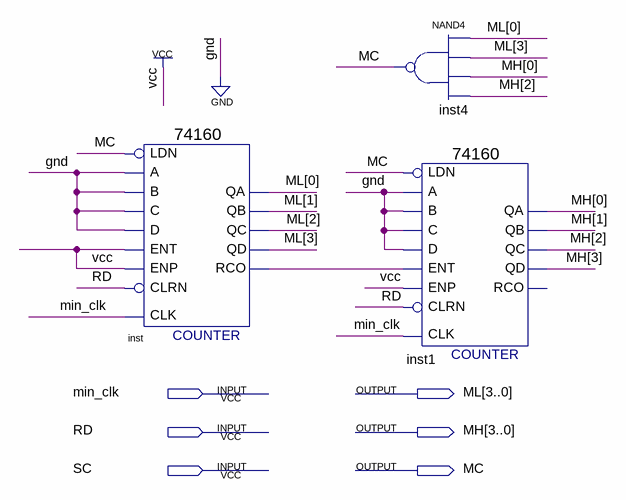
[diagram p0: schematic sheet]
// Quartus schematic min.bdf as structural Verilog: 3 symbols, 6 pins
module min (
  input  min_clk,
  input  RD,
  input  SC,
  output [3:0] ML,
  output [3:0] MH,
  output MC
);

  wire inst_rco;

  \74160  inst (
    .CLK(min_clk), .ENT(1'b1), .A(1'b0), .B(1'b0), .C(1'b0), .D(1'b0), .LDN(MC), .ENP(1'b1), .CLRN(RD),
    .QD(ML[3]), .QA(ML[0]), .QB(ML[1]), .QC(ML[2]), .RCO(inst_rco));
  nand inst4 (MC, ML[0], ML[3], MH[0], MH[2]);
  \74160  inst1 (
    .CLK(min_clk), .ENT(inst_rco), .A(1'b0), .B(1'b0), .C(1'b0), .D(1'b0), .LDN(MC), .ENP(1'b1), .CLRN(RD),
    .QD(MH[3]), .QA(MH[0]), .QB(MH[1]), .QC(MH[2]));  // open: RCO
endmodule
